# Altium project ominosc.PrjPCB (part 2 of 2)

## Sheet analog_dac.SchDoc
size A3
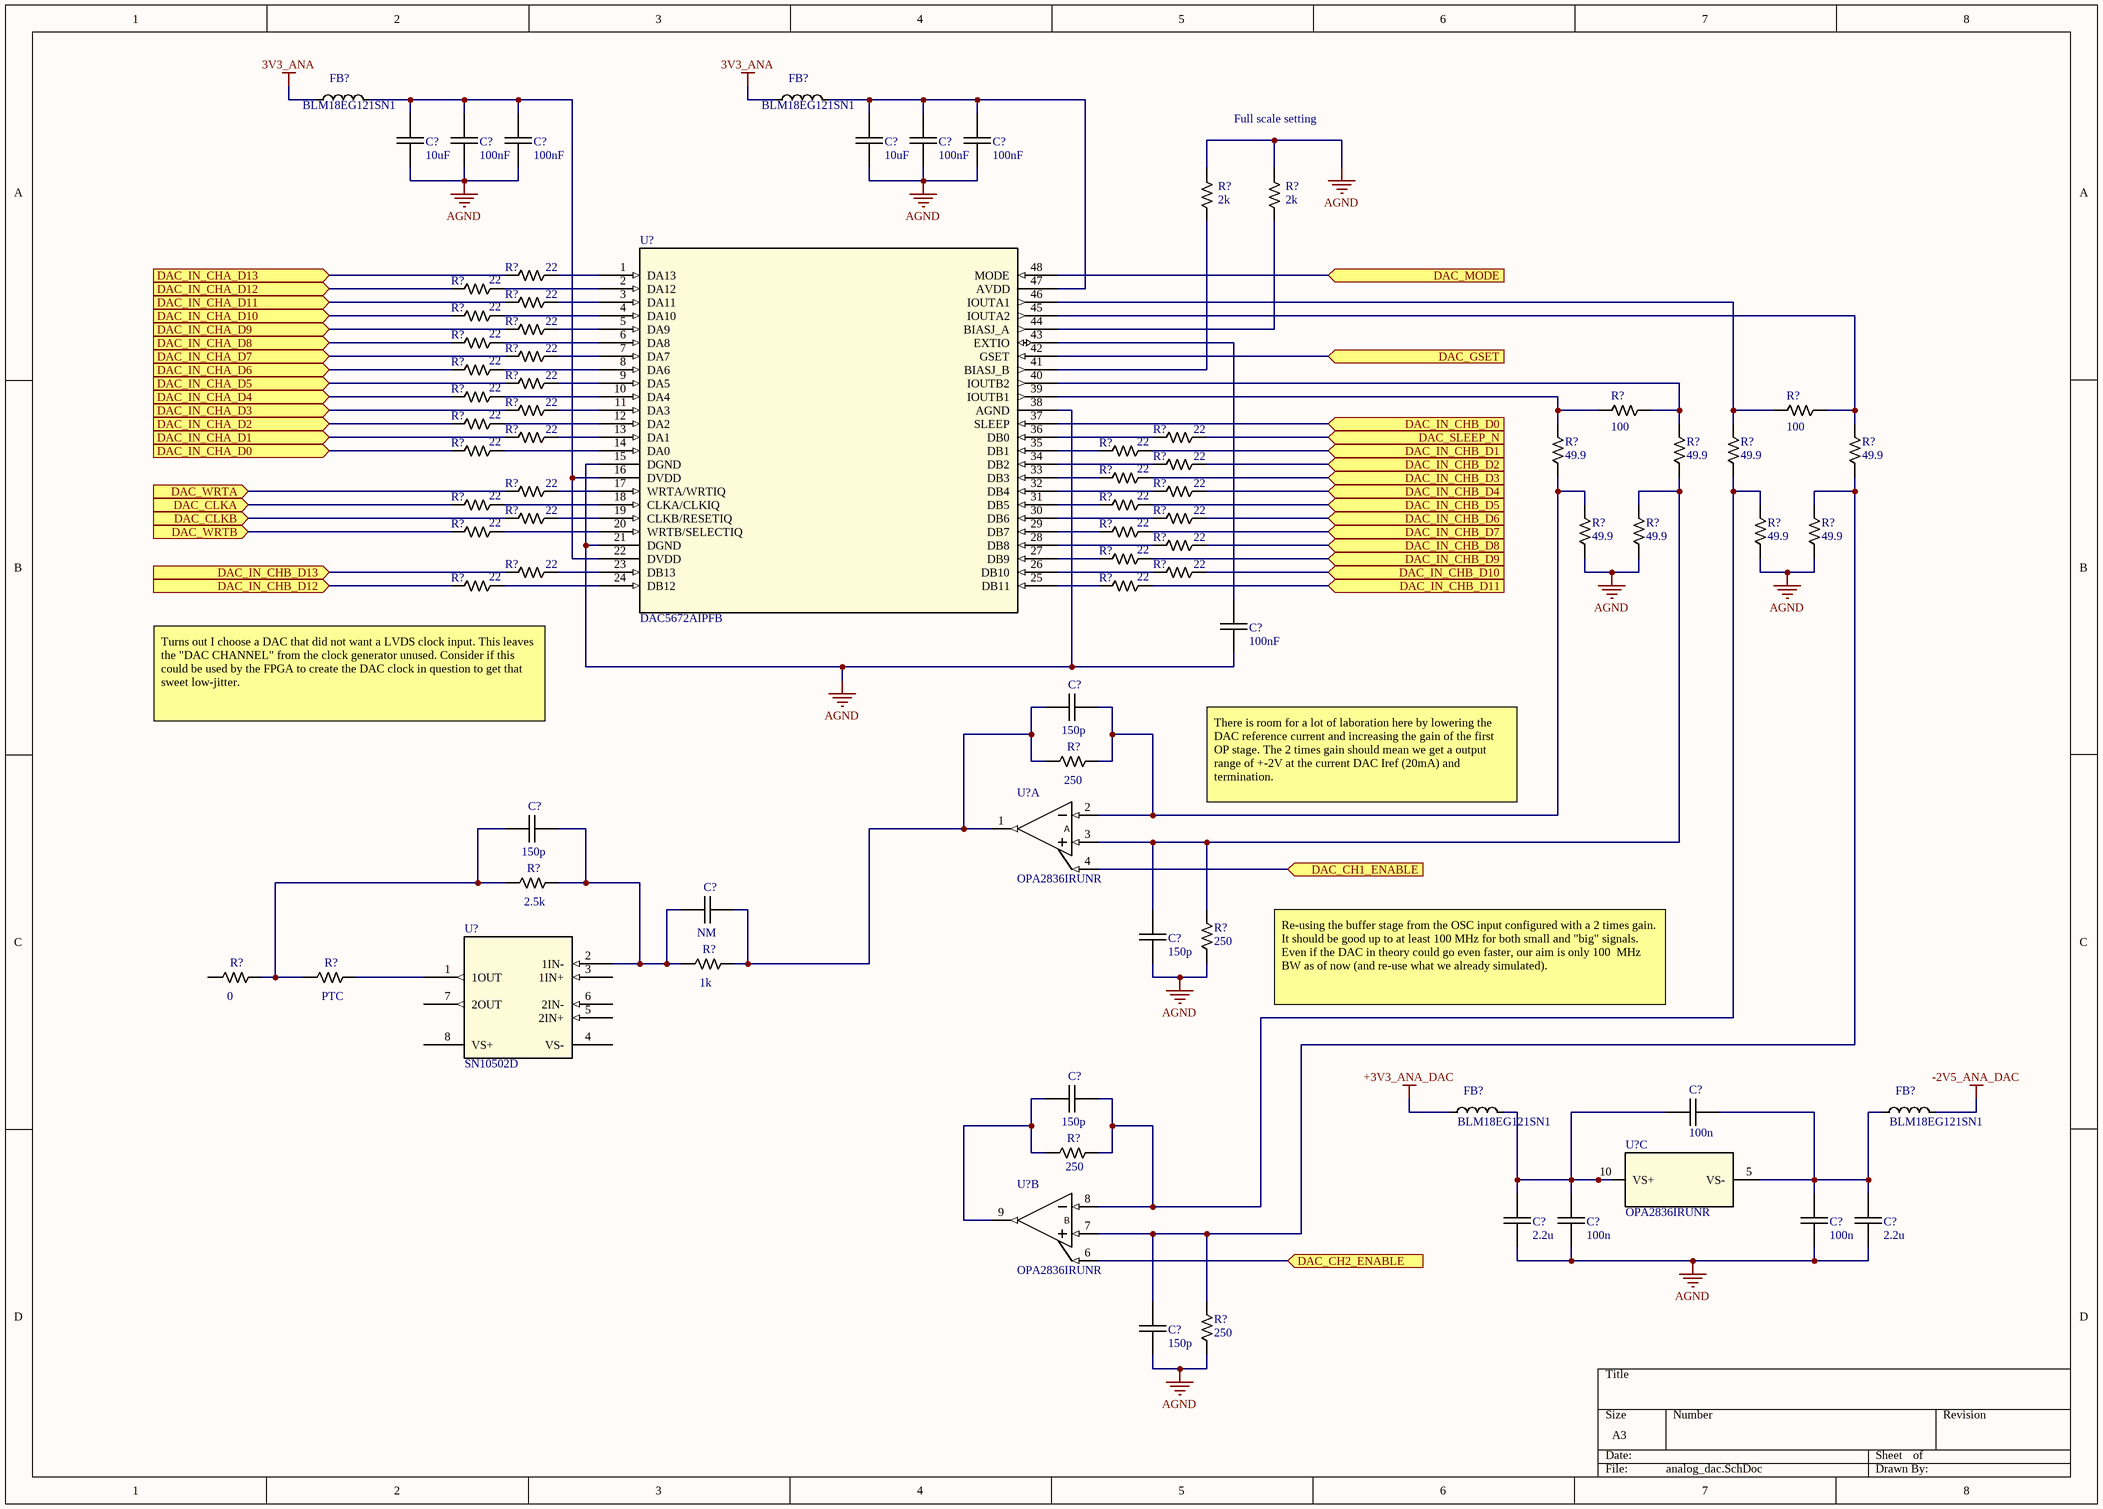
[diagram p6: analog_dac.SchDoc]

### Parts
(Parts that share a designator on the sheet are numbered #1, #2 ... from top to bottom, then left to right.)
C?#171  value 10uF  [CAPC2012X14N]  (hidden comment: MLLC Capacitor)
C?#172  value 100nF  [CAPC1005X06N]  (hidden comment: MLLC Capacitor)
C?#173  value 100nF  [CAPC1005X06N]  (hidden comment: MLLC Capacitor)
C?#174  value 10uF  [CAPC2012X14N]  (hidden comment: MLLC Capacitor)
C?#175  value 100nF  [CAPC1005X06N]  (hidden comment: MLLC Capacitor)
C?#176  value 100nF  [CAPC1005X06N]  (hidden comment: MLLC Capacitor)
C?#177  value 100nF  [CAPC1005X06N]  (hidden comment: MLLC Capacitor)
C?#178  value 150p  [CAPC1005X06N]  (hidden comment: MLLC Capacitor)
C?#179  value 150p  [CAPC1005X06N]  (hidden comment: MLLC Capacitor)
C?#180  value NM  [CAPC1005X06N]  (hidden comment: MLLC Capacitor)
C?#181  value 150p  [CAPC1005X06N]  (hidden comment: MLLC Capacitor)
C?#182  value 150p  [CAPC1005X06N]  (hidden comment: MLLC Capacitor)
C?#183  value 100n  [CAPC1005X06N]  (hidden comment: MLLC Capacitor)
C?#184  value 2.2u  [CAPC1005X06N]  (hidden comment: MLLC Capacitor)
C?#185  value 100n  [CAPC1005X06N]  (hidden comment: MLLC Capacitor)
C?#186  value 100n  [CAPC1005X06N]  (hidden comment: MLLC Capacitor)
C?#187  value 2.2u  [CAPC1005X06N]  (hidden comment: MLLC Capacitor)
C?#188  value 150p  [CAPC1005X06N]  (hidden comment: MLLC Capacitor)
FB?#18  value BLM18EG121SN1  [INDC1608X08N]  (hidden comment: Chip Inductor)
FB?#19  value BLM18EG121SN1  [INDC1608X08N]  (hidden comment: Chip Inductor)
FB?#20  value BLM18EG121SN1  [INDC1608X08N]  (hidden comment: Chip Inductor)
FB?#21  value BLM18EG121SN1  [INDC1608X08N]  (hidden comment: Chip Inductor)
R?#155  value 2k  [RESC1005X04N]  (hidden comment: Chip Resistor)
R?#156  value 2k  [RESC1005X04N]  (hidden comment: Chip Resistor)
R?#157  value 22  [RESC1005X04N]  (hidden comment: Chip Resistor)
R?#158  value 22  [RESC1005X04N]  (hidden comment: Chip Resistor)
R?#159  value 22  [RESC1005X04N]  (hidden comment: Chip Resistor)
R?#160  value 22  [RESC1005X04N]  (hidden comment: Chip Resistor)
R?#161  value 22  [RESC1005X04N]  (hidden comment: Chip Resistor)
R?#162  value 22  [RESC1005X04N]  (hidden comment: Chip Resistor)
R?#163  value 22  [RESC1005X04N]  (hidden comment: Chip Resistor)
R?#164  value 22  [RESC1005X04N]  (hidden comment: Chip Resistor)
R?#165  value 22  [RESC1005X04N]  (hidden comment: Chip Resistor)
R?#166  value 22  [RESC1005X04N]  (hidden comment: Chip Resistor)
R?#167  value 22  [RESC1005X04N]  (hidden comment: Chip Resistor)
R?#168  value 100  [RESC1005X04N]  (hidden comment: Chip Resistor)
R?#169  value 100  [RESC1005X04N]  (hidden comment: Chip Resistor)
R?#170  value 22  [RESC1005X04N]  (hidden comment: Chip Resistor)
R?#171  value 22  [RESC1005X04N]  (hidden comment: Chip Resistor)
R?#172  value 22  [RESC1005X04N]  (hidden comment: Chip Resistor)
R?#173  value 22  [RESC1005X04N]  (hidden comment: Chip Resistor)
R?#174  value 22  [RESC1005X04N]  (hidden comment: Chip Resistor)
R?#175  value 49.9  [RESC1005X04N]  (hidden comment: Chip Resistor)
R?#176  value 49.9  [RESC1005X04N]  (hidden comment: Chip Resistor)
R?#177  value 49.9  [RESC1005X04N]  (hidden comment: Chip Resistor)
R?#178  value 49.9  [RESC1005X04N]  (hidden comment: Chip Resistor)
R?#179  value 22  [RESC1005X04N]  (hidden comment: Chip Resistor)
R?#180  value 22  [RESC1005X04N]  (hidden comment: Chip Resistor)
R?#181  value 22  [RESC1005X04N]  (hidden comment: Chip Resistor)
R?#182  value 22  [RESC1005X04N]  (hidden comment: Chip Resistor)
R?#183  value 22  [RESC1005X04N]  (hidden comment: Chip Resistor)
R?#184  value 22  [RESC1005X04N]  (hidden comment: Chip Resistor)
R?#185  value 22  [RESC1005X04N]  (hidden comment: Chip Resistor)
R?#186  value 22  [RESC1005X04N]  (hidden comment: Chip Resistor)
R?#187  value 22  [RESC1005X04N]  (hidden comment: Chip Resistor)
R?#188  value 22  [RESC1005X04N]  (hidden comment: Chip Resistor)
R?#189  value 49.9  [RESC1005X04N]  (hidden comment: Chip Resistor)
R?#190  value 49.9  [RESC1005X04N]  (hidden comment: Chip Resistor)
R?#191  value 49.9  [RESC1005X04N]  (hidden comment: Chip Resistor)
R?#192  value 49.9  [RESC1005X04N]  (hidden comment: Chip Resistor)
R?#193  value 22  [RESC1005X04N]  (hidden comment: Chip Resistor)
R?#194  value 22  [RESC1005X04N]  (hidden comment: Chip Resistor)
R?#195  value 22  [RESC1005X04N]  (hidden comment: Chip Resistor)
R?#196  value 22  [RESC1005X04N]  (hidden comment: Chip Resistor)
R?#197  value 22  [RESC1005X04N]  (hidden comment: Chip Resistor)
R?#198  value 22  [RESC1005X04N]  (hidden comment: Chip Resistor)
R?#199  value 250  [RESC1005X04N]  (hidden comment: Chip Resistor)
R?#200  value 2.5k  [RESC1005X04N]  (hidden comment: Chip Resistor)
R?#201  value 250  [RESC1005X04N]  (hidden comment: Chip Resistor)
R?#202  value 1k  [RESC1005X04N]  (hidden comment: Chip Resistor)
R?#203  value 0  [RESC1005X04N]  (hidden comment: Chip Resistor)
R?#204  value PTC  [RESC1005X04N]  (hidden comment: Chip Resistor)
R?#205  value 250  [RESC1005X04N]  (hidden comment: Chip Resistor)
R?#206  value 250  [RESC1005X04N]  (hidden comment: Chip Resistor)
U?#22  DAC5672AIPFB  [PFB48]
U?#23  OPA2836IRUNR  [RUN0010A]  (part A of 3)
U?#24  SN10502D  [D8]
U?#25  OPA2836IRUNR  [RUN0010A]  (part C of 3)
U?#26  OPA2836IRUNR  [RUN0010A]  (part B of 3)

### Ports
DAC_CH1_ENABLE (in), DAC_CH2_ENABLE (in), DAC_CLKA (in), DAC_CLKB (in), DAC_GSET (in), DAC_IN_CHA_D0 (in), DAC_IN_CHA_D1 (in), DAC_IN_CHA_D2 (in), DAC_IN_CHA_D3 (in), DAC_IN_CHA_D4 (in), DAC_IN_CHA_D5 (in), DAC_IN_CHA_D6 (in), DAC_IN_CHA_D7 (in), DAC_IN_CHA_D8 (in), DAC_IN_CHA_D9 (in), DAC_IN_CHA_D10 (in), DAC_IN_CHA_D11 (in), DAC_IN_CHA_D12 (in), DAC_IN_CHA_D13 (in), DAC_IN_CHB_D0 (in), DAC_IN_CHB_D1 (in), DAC_IN_CHB_D2 (in), DAC_IN_CHB_D3 (in), DAC_IN_CHB_D4 (in), DAC_IN_CHB_D5 (in), DAC_IN_CHB_D6 (in), DAC_IN_CHB_D7 (in), DAC_IN_CHB_D8 (in), DAC_IN_CHB_D9 (in), DAC_IN_CHB_D10 (in), DAC_IN_CHB_D11 (in), DAC_IN_CHB_D12 (in), DAC_IN_CHB_D13 (in), DAC_MODE (in), DAC_SLEEP_N (in), DAC_WRTA (in), DAC_WRTB (in)

### Nets
3V3_ANA: FB?#18.1 FB?#19.1
+3V3_ANA_DAC: FB?#20.1
-2V5_ANA_DAC: FB?#21.2
AGND: C?#171.2 C?#172.2 C?#173.2 C?#174.2 C?#175.2 C?#176.2 C?#177.2 C?#181.1 C?#184.1 C?#185.1 C?#186.1 C?#187.1 C?#188.1 R?#155.1 R?#156.1 R?#189.1 R?#190.1 R?#191.1 R?#192.1 R?#201.1 R?#206.1 U?#22.15(DGND) U?#22.21(DGND) U?#22.38(AGND)
NetC?#171_1: C?#171.1 C?#172.1 C?#173.1 FB?#18.2 U?#22.16(DVDD) U?#22.22(DVDD)
NetC?#174_1: C?#174.1 C?#175.1 C?#176.1 FB?#19.2 U?#22.47(AVDD)
NetC?#177_1: C?#177.1 U?#22.43(EXTIO)
NetC?#178_1: C?#178.1 C?#180.2 R?#199.1 R?#202.2 U?#23.1(VOUT1)
NetC?#178_2: C?#178.2 R?#175.1 R?#189.2 R?#199.2 U?#23.2(IN-)
NetC?#179_1: C?#179.1 R?#200.1 R?#203.2 R?#204.1
NetC?#179_2: C?#179.2 C?#180.1 R?#200.2 R?#202.1 U?#24.2(1IN-)
NetC?#181_2: C?#181.2 R?#176.1 R?#190.2 R?#201.2 U?#23.3(IN+)
NetC?#182_1: C?#182.1 R?#205.1 U?#26.9(VOUT2)
NetC?#182_2: C?#182.2 R?#177.1 R?#191.2 R?#205.2 U?#26.8(IN-)
NetC?#183_1: C?#183.1 C?#186.2 C?#187.2 FB?#21.1 U?#25.5(VS-)
NetC?#183_2: C?#183.2 C?#184.2 C?#185.2 FB?#20.2 U?#25.10(VS+)
NetC?#188_2: C?#188.2 R?#178.1 R?#192.2 R?#206.2 U?#26.7(IN+)
NetR?#155_2: R?#155.2 U?#22.41(BIASJ_B)
NetR?#156_2: R?#156.2 U?#22.44(BIASJ_A)
NetR?#157_1: R?#157.1 U?#22.1(DA13)
NetR?#157_2: R?#157.2 ; port DAC_IN_CHA_D13
NetR?#158_1: R?#158.1 U?#22.2(DA12)
NetR?#158_2: R?#158.2 ; port DAC_IN_CHA_D12
NetR?#159_1: R?#159.1 U?#22.3(DA11)
NetR?#159_2: R?#159.2 ; port DAC_IN_CHA_D11
NetR?#160_1: R?#160.1 U?#22.4(DA10)
NetR?#160_2: R?#160.2 ; port DAC_IN_CHA_D10
NetR?#161_1: R?#161.1 U?#22.5(DA9)
NetR?#161_2: R?#161.2 ; port DAC_IN_CHA_D9
NetR?#162_1: R?#162.1 U?#22.6(DA8)
NetR?#162_2: R?#162.2 ; port DAC_IN_CHA_D8
NetR?#163_1: R?#163.1 U?#22.7(DA7)
NetR?#163_2: R?#163.2 ; port DAC_IN_CHA_D7
NetR?#164_1: R?#164.1 U?#22.8(DA6)
NetR?#164_2: R?#164.2 ; port DAC_IN_CHA_D6
NetR?#165_1: R?#165.1 U?#22.9(DA5)
NetR?#165_2: R?#165.2 ; port DAC_IN_CHA_D5
NetR?#166_1: R?#166.1 U?#22.10(DA4)
NetR?#166_2: R?#166.2 ; port DAC_IN_CHA_D4
NetR?#167_1: R?#167.1 U?#22.11(DA3)
NetR?#167_2: R?#167.2 ; port DAC_IN_CHA_D3
NetR?#168_1: R?#168.1 R?#176.2 U?#22.40(IOUTB2)
NetR?#168_2: R?#168.2 R?#175.2 U?#22.39(IOUTB1)
NetR?#169_1: R?#169.1 R?#178.2 U?#22.45(IOUTA2)
NetR?#169_2: R?#169.2 R?#177.2 U?#22.46(IOUTA1)
NetR?#170_1: R?#170.1 U?#22.12(DA2)
NetR?#170_2: R?#170.2 ; port DAC_IN_CHA_D2
NetR?#171_1: R?#171.1 U?#22.13(DA1)
NetR?#171_2: R?#171.2 ; port DAC_IN_CHA_D1
NetR?#172_1: R?#172.1 ; port DAC_SLEEP_N
NetR?#172_2: R?#172.2 U?#22.36(DB0)
NetR?#173_1: R?#173.1 U?#22.14(DA0)
NetR?#173_2: R?#173.2 ; port DAC_IN_CHA_D0
NetR?#174_1: R?#174.1 ; port DAC_IN_CHB_D1
NetR?#174_2: R?#174.2 U?#22.35(DB1)
NetR?#179_1: R?#179.1 ; port DAC_IN_CHB_D2
NetR?#179_2: R?#179.2 U?#22.34(DB2)
NetR?#180_1: R?#180.1 ; port DAC_IN_CHB_D3
NetR?#180_2: R?#180.2 U?#22.33(DB3)
NetR?#181_1: R?#181.1 U?#22.17(WRTA/WRTIQ)
NetR?#181_2: R?#181.2 ; port DAC_WRTA
NetR?#182_1: R?#182.1 ; port DAC_IN_CHB_D4
NetR?#182_2: R?#182.2 U?#22.32(DB4)
NetR?#183_1: R?#183.1 U?#22.18(CLKA/CLKIQ)
NetR?#183_2: R?#183.2 ; port DAC_CLKA
NetR?#184_1: R?#184.1 ; port DAC_IN_CHB_D5
NetR?#184_2: R?#184.2 U?#22.31(DB5)
NetR?#185_1: R?#185.1 U?#22.19(CLKB/RESETIQ)
NetR?#185_2: R?#185.2 ; port DAC_CLKB
NetR?#186_1: R?#186.1 ; port DAC_IN_CHB_D6
NetR?#186_2: R?#186.2 U?#22.30(DB6)
NetR?#187_1: R?#187.1 U?#22.20(WRTB/SELECTIQ)
NetR?#187_2: R?#187.2 ; port DAC_WRTB
NetR?#188_1: R?#188.1 ; port DAC_IN_CHB_D7
NetR?#188_2: R?#188.2 U?#22.29(DB7)
NetR?#193_1: R?#193.1 ; port DAC_IN_CHB_D8
NetR?#193_2: R?#193.2 U?#22.28(DB8)
NetR?#194_1: R?#194.1 ; port DAC_IN_CHB_D9
NetR?#194_2: R?#194.2 U?#22.27(DB9)
NetR?#195_1: R?#195.1 U?#22.23(DB13)
NetR?#195_2: R?#195.2 ; port DAC_IN_CHB_D13
NetR?#196_1: R?#196.1 ; port DAC_IN_CHB_D10
NetR?#196_2: R?#196.2 U?#22.26(DB10)
NetR?#197_1: R?#197.1 U?#22.24(DB12)
NetR?#197_2: R?#197.2 ; port DAC_IN_CHB_D12
NetR?#198_1: R?#198.1 ; port DAC_IN_CHB_D11
NetR?#198_2: R?#198.2 U?#22.25(DB11)
NetR?#204_2: R?#204.2 U?#24.1(1OUT)
NetU?#22_37: U?#22.37(SLEEP) ; port DAC_IN_CHB_D0
NetU?#22_42: U?#22.42(GSET) ; port DAC_GSET
NetU?#22_48: U?#22.48(MODE) ; port DAC_MODE
NetU?#23_4: U?#23.4(PD1_N) ; port DAC_CH1_ENABLE
NetU?#26_6: U?#26.6(PD2_N) ; port DAC_CH2_ENABLE

Not connected (* = marked no-connect by the designer): R?#203 1; U?#24 3(1IN+) 4(VS-) 5(2IN+) 6(2IN-) 7(2OUT) 8(VS+)

### Notes on the sheet
- Full scale setting
- (near R?#197) Turns out I choose a DAC that did not want a LVDS clock input. This leaves the "DAC CHANNEL" from the clock generator unused. Consider if this could be used by the FPGA to create the DAC clock in question to get that sweet low-jitter.
- There is room for a lot of laboration here by lowering the DAC reference current and increasing the gain of the first OP stage. The 2 times gain should mean we get a output range of +-2V at the current DAC Iref (20mA) and termination.
- Re-using the buffer stage from the OSC input configured with a 2 times gain. It should be good up to at least 100 MHz for both small and "big" signals. Even if the DAC in theory could go even faster, our aim is only 100  MHz BW as of now (and re-use what we already simulated).
- (in symbol OPA2836IRUNR, part A) A
- (in symbol OPA2836IRUNR, part B) B

### Library data of the parts
C?#171-C?#188 = Cap: Rating: *
FB?#18-FB?#21 = Ind
R?#155-R?#206 = Res
U?#22 = DAC5672A: Dual-Channel, 14-Bit, 275-MSPS Digital-to-Analog Converter (DAC); Manufacturer: Texas Instruments; INDUSTRY_STD_PKG_TYPE: TQFP; FAMILY_NAME: HIGH SPEED DAC (>10MSPS); PIN_COUNT: 48; PACKAGE_DESIGNATOR: PFB; Datasheet_URL: http://www.ti.com/lit/gpn/DAC5672A; GENERIC_PART_NUMBER: DAC5672A; Copyright: Copyright (C) 2018 Accelerated Designs. All rights reserved; RefDes: RefDes; Type: DEV; ComponentLink1Description: Product Page; ComponentLink1URL: https://www.ti.com/product/DAC5672A
U?#23 U?#25 U?#26 = OPA2836IRUNR: Dual, Very Low Power, Rail to Rail out, Negative Rail in, VFB Op Amp, 205MHz BW, 120 MHz GBW; Manufacturer: Texas Instruments; PartNumber: OPA2836IRUNR; RefDes: RefDes; Type: DEV; Value: Value; Copyright: Copyright (C) 2018 Accelerated Designs. All rights reserved; ComponentLink1Description: Product Page; ComponentLink1URL: https://www.ti.com/product/OPA2836
U?#24 = SN10502D: Low-Distortion High-Speed Rail-to-Rail Output Operational Amplifiers; Manufacturer: Texas Instruments; INDUSTRY_STD_PKG_TYPE: SOIC; FAMILY_NAME: VOLTAGE FEEDBACK; PIN_COUNT: 8; PACKAGE_DESIGNATOR: D; Datasheet_URL: http://www.ti.com/lit/gpn/SN10502; GENERIC_PART_NUMBER: SN10502; Vendor: Texas Instruments; Manufacturer_Part_Number: SN10502D; Copyright: Copyright (C) 2018 Accelerated Designs. All rights reserved; RefDes: RefDes; Type: DEV

## Sheet analog_dac_ref_offset.SchDoc
size A4

## Nets that join several sheets
1V8_ADC_ANA: analog_adc (9 pins), analog_power (C?#139.1 C?#140.1 C?#141.1 U?#16.1)
1V8_ADC_DIG: analog_adc (5 pins), analog_power (C?#153.1 C?#154.1 C?#155.1 U?#18.1)
3V3_ANA: analog_clock_gen (19 pins), analog_adc_ref_offset (FB?#17.1), analog_power (31 pins), analog_dac (FB?#18.1 FB?#19.1)
+3V3_ANA_DAC: analog_power (C?#165.1 R?#150.1 U?#20.9 U?#20.10), analog_dac (FB?#20.1)
+3V3_ANA_FE: analog_osc_front_end (FB?#1.1 FB?#5.1), analog_power (C?#170.1 R?#154.1 U?#21.9 U?#21.10)
+5V_ANA: analog_osc_front_end (FB?#4.1 FB?#8.1), analog_adc_ref_offset (C?#120.2 U?#14.3), analog_power (C?#156.1 U?#19.3)
-2V5_ANA_DAC: analog_power (C?#163.1 R?#147.2 U?#20.2 U?#20.3), analog_dac (FB?#21.2)
-2V5_ANA_FE: analog_osc_front_end (FB?#2.2 FB?#6.2), analog_power (C?#168.1 R?#151.2 U?#21.2 U?#21.3)
-5_ANA: analog_osc_front_end (FB?#3.1 FB?#7.1), analog_adc_front_end (FB?#11.2 FB?#13.2 FB?#14.2), analog_adc_ref_offset (C?#124.2 U?#14.10), analog_power (C?#160.1 U?#19.9)
AGND: analog_osc_front_end (32 pins), analog_adc_front_end (27 pins), analog_clock_gen (23 pins), analog_adc_ref_offset (15 pins), analog_adc (22 pins), analog_dac (24 pins)
DAC_REF_OUT: analog_adc_front_end (R?#62.2), analog_adc_ref_offset (R?#98.1 R?#100.2 U?#14.4 U?#14.9)
NetC?#15_2: analog_osc_front_end (C?#15.2 R?#11.2 U?#2.1), analog_adc_front_end (C?#68.1 R?#52.1)
NetC?#17_2: analog_osc_front_end (C?#17.2 R?#14.2 U?#4.9), analog_adc_front_end (C?#71.1 R?#57.1)
NetC?#46_2: analog_osc_front_end (C?#46.2 R?#35.2 U?#6.1), analog_adc_front_end (C?#88.1 R?#70.1)
NetC?#48_2: analog_osc_front_end (C?#48.2 R?#38.2 U?#8.9), analog_adc_front_end (C?#93.1 R?#75.1)
NetC?#66_1: analog_adc_front_end (C?#66.1 R?#49.1), analog_adc_ref_offset (C?#121.1 R?#103.2 U?#14.6)
NetC?#72_2: analog_adc_front_end (C?#72.2 D?#1.3 R?#54.2), analog_adc (U?#15.30)
NetC?#73_2: analog_adc_front_end (C?#73.2 D?#2.3 R?#55.2), analog_adc (U?#15.29)
NetC?#77_1: analog_adc_front_end (C?#77.1 R?#60.1), analog_adc_ref_offset (C?#119.2 R?#101.1 U?#14.15)
NetC?#86_1: analog_adc_front_end (C?#86.1 R?#67.1), analog_adc_ref_offset (C?#122.1 R?#104.2 U?#14.7)
NetC?#94_2: analog_adc_front_end (C?#94.2 D?#3.3 R?#72.2), analog_adc (U?#15.20)
NetC?#95_2: analog_adc_front_end (C?#95.2 D?#4.3 R?#73.2), analog_adc (U?#15.19)
NetC?#97_1: analog_adc_front_end (C?#97.1 R?#78.1), analog_adc_ref_offset (C?#123.1 R?#105.2 U?#14.14)
NetC?#130_2: analog_clock_gen (U?#12.3), analog_adc (C?#130.2 R?#140.2)
NetC?#131_2: analog_clock_gen (U?#12.2), analog_adc (C?#131.2 R?#140.1)
NetC?#132_1: analog_adc_front_end (U?#9.2 U?#10.2 U?#11.2), analog_adc (C?#132.1 U?#15.23)